# EAGLE design RocketometerATMega (EAGLE 6.3)
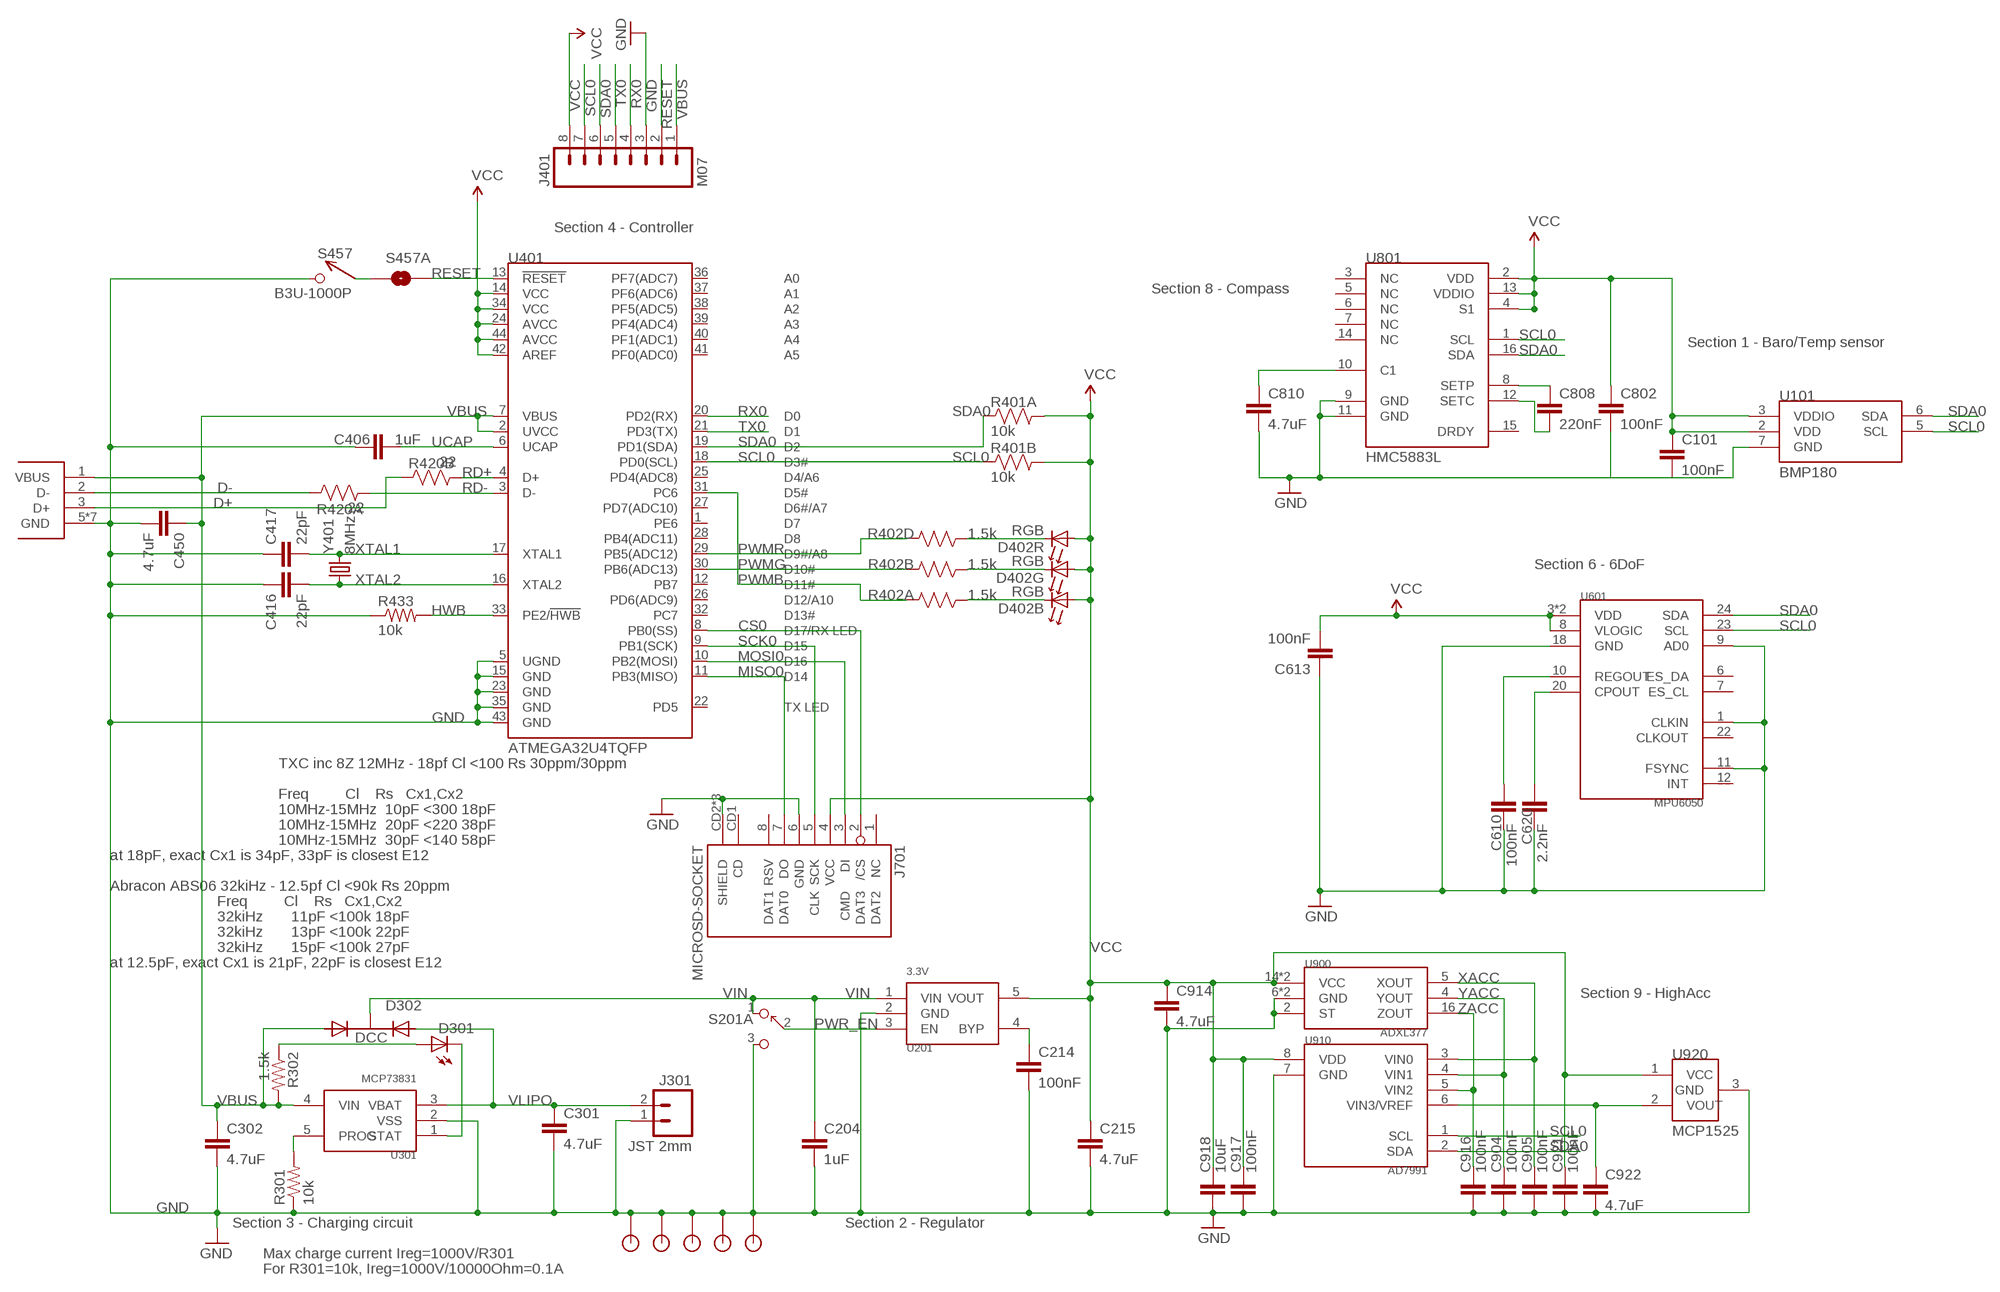
[diagram p0: schematic, sheet 1]

## Parts
C101  100nF  CAP0402-CAP  [0402-CAP]
C204  1uF  CAP0402-CAP  [0402-CAP]
C214  100nF  CAP0402-CAP  [0402-CAP]
C215  4.7uF  CAP0402-CAP  [0402-CAP]
C301  4.7uF  CAP0402-CAP  [0402-CAP]
C302  4.7uF  CAP0402-CAP  [0402-CAP]
C406  1uF  CAP0402-CAP  [0402-CAP]
C416  22pF  CAP0402-CAP  [0402-CAP]
C417  22pF  CAP0402-CAP  [0402-CAP]
C450  4.7uF  CAP0402-CAP  [0402-CAP]
C610  100nF  CAP0402-CAP  [0402-CAP]
C613  100nF  CAP0402-CAP  [0402-CAP]
C620  2.2nF  CAP0402-CAP  [0402-CAP]
C802  100nF  CAP0402-CAP  [0402-CAP]
C808  220nF  CAP0402-CAP  [0402-CAP]
C810  4.7uF  CAP0402-CAP  [0402-CAP]
C904  100nF  CAP0402-CAP  [0402-CAP]
C905  100nF  CAP0402-CAP  [0402-CAP]
C914  4.7uF  CAP0402-CAP  [0402-CAP]
C916  100nF  CAP0402-CAP  [0402-CAP]
C917  100nF  CAP0402-CAP  [0402-CAP]
C918  10uF  CAP0603-CAP  [0603-CAP]
C921  100nF  CAP0402-CAP  [0402-CAP]
C922  4.7uF  CAP0402-CAP  [0402-CAP]
D301  YELLOW  LED0603  [LED-0603]
D302  DCC  PMEG2005CT  [SOT-23-3]
D402  RGB  SMLP36RGB2W(R)  [SMLP36]
J301  JST 2mm  M02-JST-2MM-SMT  [JST-2-SMD]
J400  USB_MICROB_JSTGCT  [USB_MICROB_3075]
J401  M07  M081X08  [1X08]
J701  MICROSD-SOCKET  [MICROSD-SOCKET-PP]
JP1  STANDOFF  [STANDOFF]
JP2  STANDOFF  [STANDOFF]
JP3  STANDOFF  [STANDOFF]
JP4  STANDOFF  [STANDOFF]
JP5  STANDOFF  [STANDOFF]
R301  10k  RESISTOR0402-RES  [0402-RES]
R302  1.5k  RESISTOR0402-RES  [0402-RES]
R401  10k  RP2EXB24V  [CRA02]
R402  1.5k  RP404  [CRA04]
R420  22  RP2EXB24V  [CRA02]
R433  10k  RESISTOR0402-RES  [0402-RES]
S201  AYZ0202  [AYZ0202]
S457  B3U-1000P  [B3U-1000P]
S457A  SOLDERJUMPERNO  [SJ_2S-NO]
U101  BMP180  [BMP180]
U201  3.3V  MIC5319D5  [SOT-23-5]
U301  MCP73831  [SOT-23-5]
U401  ATMEGA32U4TQFP  [SPARKFUN-DIGITALIC_TQFP44]
U601  MPU6050  [MPU60X0]
U801  HMC5883L  HMC5883LSMD  [16LPCC]
U900  ADXL377  [ADXL377]
U910  AD7991  AD799X  [SOT-23-8]
U920  MCP1525  [SOT-23-3]
Y401  8MHz  NX3225GD  [CRYSTAL_SMD_3_2MM_2_5MM]

## Nets
CS0: J701.2(/CS) U401.8(PB0(SS))
D+: J400.3(D+) R420.2
D-: J400.2(D-) R420.1
GND [power]: C101.2 C204.2 C214.2 C215.2 C301.2 C302.2 C406.2 C416.1 C417.1 C450.2 C610.2 C613.1 C620.1 C802.2 C810.2 C904.2 C905.2 C914.2 C916.2 C917.2 C918.2 C921.2 C922.2 J301.1 J400.5(GND) J400.P$1(GND) J400.P$2(GND) J400.P$3(GND) J400.P$4(GND) J400.P$8(GND) J400.P$10(GND) J401.3 J701.6(GND) J701.CD2(SHIELD) J701.GND1(SHIELD) J701.GND3(SHIELD) JP1.P$1 JP2.P$1 JP3.P$1 JP4.P$1 JP5.P$1 R301.1 R433.1 S201.3 S457.P$2 U101.7(GND) U201.2(GND) U301.2(VSS) U401.5(UGND) U401.15(GND) U401.23(GND) U401.35(GND) U401.43(GND) U601.1(CLKIN) U601.9(AD0) U601.11(FSYNC) U601.18(GND) U801.9(GND) U801.11(GND) U900.2(ST) U900.6(GND) U900.7(GND) U910.7(GND) U920.3(GND)
HWB: R433.2 U401.33(PE2/!HWB)
MISO0: J701.7(DO) U401.11(PB3(MISO))
MOSI0: J701.3(DI) U401.10(PB2(MOSI))
N$1: C620.2 U601.20(CPOUT)
N$2: R301.2 U301.5(PROG)
N$3 [power]: S457.P$1 S457A.1
N$4: D301.C U301.1(STAT)
N$5: D301.A R302.1
N$10: C922.1 U910.6(VIN3/VREF) U920.2(VOUT)
N$13: C610.1 U601.10(REGOUT)
N$14: C808.1 U801.8(SETP)
N$15: C808.2 U801.12(SETC)
N$16: C810.1 U801.10(C1)
N$17: C214.1 U201.4(BYP)
PWMB: R402.8 U401.31(PC6)
PWMG: R402.7 U401.30(PB6(ADC13))
PWMR: R402.5 U401.29(PB5(ADC12))
PWR_EN: S201.2 U201.3(EN)
QWMB: D402.1(B:C) R402.1
QWMG: D402.3(G:C) R402.2
QWMR: D402.5(R:C) R402.4
RD+: R420.3 U401.4(D+)
RD-: R420.4 U401.3(D-)
RESET [power]: J401.2 S457A.2 U401.13(!RESET)
RX0: J401.4 U401.20(PD2(RX))
SCK0: J701.5(SCK) U401.9(PB1(SCK))
SCL0: J401.7 R401.2 U101.5(SCL) U401.18(PD0(SCL)) U601.23(SCL) U801.1(SCL) U910.1(SCL)
SDA0: J401.6 R401.1 U101.6(SDA) U401.19(PD1(SDA)) U601.24(SDA) U801.16(SDA) U910.2(SDA)
TX0: J401.5 U401.21(PD3(TX))
UCAP: C406.1 U401.6(UCAP)
VBUS: C302.1 C450.1 D302.1(A1) J400.1(VBUS) J401.1 R302.2 U301.4(VIN) U401.2(UVCC) U401.7(VBUS)
VCC [power]: C101.1 C215.1 C613.2 C802.1 C914.1 C917.1 C918.1 C921.1 D402.2(B:A) D402.4(G:A) D402.6(R:A) J401.8 J701.4(VCC) R401.3 R401.4 U101.2(VDD) U101.3(VDDIO) U201.5(VOUT) U401.14(VCC) U401.24(AVCC) U401.34(VCC) U401.42(AREF) U401.44(AVCC) U601.3(VDD) U601.8(VLOGIC) U601.13(VDD) U801.2(VDD) U801.4(S1) U801.13(VDDIO) U900.14(VCC) U900.15(VCC) U910.8(VDD) U920.1(VCC)
VIN: C204.1 D302.3(K) S201.1 U201.1(VIN)
VLIPO: C301.1 D302.2(A2) J301.2 U301.3(VBAT)
XACC: C905.1 U900.5(XOUT) U910.3(VIN0)
XTAL1: C417.2 U401.17(XTAL1) Y401.2
XTAL2: C416.2 U401.16(XTAL2) Y401.1
YACC: C904.1 U900.4(YOUT) U910.4(VIN1)
ZACC: C916.1 U900.16(ZOUT) U910.5(VIN2)
Unconnected: J701.1(NC) J701.8(RSV) J701.CD1(CD) R402.3 R402.6 S201.4 S201.5 S201.6 U401.1(PE6) U401.12(PB7) U401.22(PD5) U401.25(PD4(ADC8)) U401.26(PD6(ADC9)) U401.27(PD7(ADC10)) U401.28(PB4(ADC11)) U401.32(PC7) U401.36(PF7(ADC7)) U401.37(PF6(ADC6)) U401.38(PF5(ADC5)) U401.39(PF4(ADC4)) U401.40(PF1(ADC1)) U401.41(PF0(ADC0)) U601.6(ES_DA) U601.7(ES_CL) U601.12(INT) U601.22(CLKOUT) U801.3(NC) U801.5(NC) U801.6(NC) U801.7(NC) U801.14(NC) U801.15(DRDY)

## Notes on the sheet
- Section 4 - Controller
- Section 8 - Compass
- Section 1 - Baro/Temp sensor
- Section 6 - 6DoF
- TXC inc 8Z 12MHz - 18pf Cl <100 Rs 30ppm/30ppm
- Freq         Cl    Rs   Cx1,Cx2
- 10MHz-15MHz  10pF <300 18pF
- 10MHz-15MHz  20pF <220 38pF
- 10MHz-15MHz  30pF <140 58pF
- at 18pF, exact Cx1 is 34pF, 33pF is closest E12
- Abracon ABS06 32kiHz - 12.5pf Cl <90k Rs 20ppm
- Freq         Cl    Rs   Cx1,Cx2
- 32kiHz       11pF <100k 18pF
- 32kiHz       13pF <100k 22pF
- 32kiHz       15pF <100k 27pF
- at 12.5pF, exact Cx1 is 21pF, 22pF is closest E12
- Section 9 - HighAcc
- Section 3 - Charging circuit | Section 2 - Regulator
- Max charge current Ireg=1000V/R301
- For R301=10k, Ireg=1000V/10000Ohm=0.1A

## Library data of the parts
C101 C214 C610 C613 C802 C904 C905 C916 = SparkFun:CAP: Capacitor Standard 0603 ceramic capacitor, and 0.1" leaded capacitor.; DIGIKEY: 445-1265-1-ND
C204 = SparkFun:CAP: Capacitor Standard 0603 ceramic capacitor, and 0.1" leaded capacitor.; DIGIKEY: 445-4114-1-ND
C215 C301 C302 C810 C914 C922 = SparkFun:CAP: Capacitor Standard 0603 ceramic capacitor, and 0.1" leaded capacitor.; DIGIKEY: 445-7395-1-ND
C406 = SparkFun-Passives:CAP: Capacitor Standard 0603 ceramic capacitor, and 0.1" leaded capacitor.; DIGIKEY: 445-4114-1-ND
C416 C417 = SparkFun:CAP: Capacitor Standard 0603 ceramic capacitor, and 0.1" leaded capacitor.; DIGIKEY: 445-1239-1-ND
C450 = SparkFun-Passives:CAP: Capacitor Standard 0603 ceramic capacitor, and 0.1" leaded capacitor.; DIGIKEY: 445-7395-1-ND
C620 = SparkFun:CAP: Capacitor Standard 0603 ceramic capacitor, and 0.1" leaded capacitor.; DIGIKEY: 445-1257-1-ND
C808 = SparkFun:CAP: Capacitor Standard 0603 ceramic capacitor, and 0.1" leaded capacitor.; DIGIKEY: 445-5938-1-ND
C917 C921 = SparkFun-Passives:CAP: Capacitor Standard 0603 ceramic capacitor, and 0.1" leaded capacitor.; DIGIKEY: 445-1265-1-ND
C918 = SparkFun:CAP: Capacitor Standard 0603 ceramic capacitor, and 0.1" leaded capacitor.; DIGIKEY: 445-7486-1-ND
D301 = SparkFun:LED: LEDs Standard schematic elements and footprints for 5mm, 3mm, 1206, and 0603 sized LEDs. 5mm - Spark Fun Electronics SKU : COM-00529 (and others); DIGIKEY: 350-2032-1-ND
D302 = KwanSystems:PMEG2005CT; DIGIKEY: 568-6500-1-ND
D402 = KwanSystems:SMLP36RGB2W(R); DIGIKEY: 846-1097-1-ND
J301 = SparkFun:M02: Header 2 Standard 2-pin 0.1" header. Use with straight break away headers (SKU : PRT-00116), right angle break away headers (PRT-00553), swiss pins (PRT-00743), machine pins (PRT-00117), and female headers (PRT-00115). Molex polarized connector foot print use with SKU : PRT-08233 with associated crimp pins and housings.; DIGIKEY: 455-1749-1-ND
J400 = KwanSystems:USB_MICROB_JST; DIGIKEY: 609-4616-2-ND
J401 = SparkFun-Connectors:M08: Header 8 Standard 8-pin 0.1" header. Use with straight break away headers (SKU : PRT-00116), right angle break away headers (PRT-00553), swiss pins (PRT-00743), machine pins (PRT-00117), and female headers (PRT-00115).; DIGIKEY: $NOPART
J701 = KwanSystems:MICROSD-SOCKET: microSD Socket Push-push type uSD socket. Digikey 101-00660-68-6-1-ND. tDoc lines correctly indicate media card edge positions when inserting (unlocked, locked, depressed).; DIGIKEY: 101-00581-59-1-ND
JP1-JP5 = KwanSystems:STANDOFF; DIGIKEY: $NOPART
R301 = SparkFun:RESISTOR: Resistor Basic schematic elements and footprints for 0603, 1206, and PTH resistors.; DIGIKEY: P10.0KLCT-ND
R302 = SparkFun:RESISTOR: Resistor Basic schematic elements and footprints for 0603, 1206, and PTH resistors.; DIGIKEY: P1.50KLCT-ND
R401 = KwanSystems:RP2; DIGIKEY: Y5103CT-ND
R402 = KwanSystems:RP4; DIGIKEY: CRA4S81.5KCT-ND
R420 = KwanSystems:RP2; DIGIKEY: Y5220CT-ND
R433 = SparkFun-Passives:RESISTOR: Resistor Basic schematic elements and footprints for 0603, 1206, and PTH resistors.; DIGIKEY: P10.0KLCT-ND
S201 = KwanSystems:AYZ0202; DIGIKEY: 401-2013-1-ND
S457 = KwanSystems:B3U-1000P; DIGIKEY: SW1020CT-ND
S457A = SparkFun-Passives:SOLDERJUMPER: Solder Jumper Standard SMD solder jumper. Used to automate production. Two varients : Normally Open and Normally Closed are the same, but have different paste layers. NC will have a large amount of paste and should jumper during reflow.; DIGIKEY: $NOPART
U101 = KwanSystems:BMP180; DIGIKEY: 828-1027-1-ND
U201 = KwanSystems:MIC5319; DIGIKEY: 576-1910-1-ND
U301 = KwanSystems:MCP73831; DIGIKEY: 576-1910-1-ND
U401 = SparkFun-DigitalIC:ATMEGA32U4: Atmel 44-pin 8-bit Microcontroller with 32KBytes of ISP Flash and USB Controller; DIGIKEY: ATMEGA32U4-AURCT-ND
U601 = KwanSystems:MPU6050: MPU6050 or MPU9150 Pin 3 is NC on the '6050, VDD on the '9150. Since pin 3 is not internally connected, a socket for the '9150 is compatible with a '6050.; DIGIKEY: $NOPART
U801 = SparkFun:HMC5883L: 3 Axis Digital Compass IC; DIGIKEY: 342-1082-1-ND; LABEL_3D50: 5883
U900 = KwanSystems:ADXL377; DIGIKEY: ADXL377BCPZ-RL7CT-ND
U910 = KwanSystems:AD799X; DIGIKEY: AD7991YRJZ-0500RL7CT-ND
U920 = KwanSystems:MCP1525; DIGIKEY: MCP1525T-I/TTCT-ND
Y401 = KwanSystems:NX3225GD; DIGIKEY: 644-1178-1-ND

## Net classes
0 default: width 0.152 mm, drill 0.33 mm, clearance 0.152 mm
1 power: width 0.152 mm, drill 0.33 mm, clearance 0.152 mm to class 0, clearance 0.152 mm
2 hv: width 0.152 mm, drill 0.33 mm, clearance 0.152 mm to class 0, clearance 0.152 mm to class 1, clearance 0.152 mm

## Board
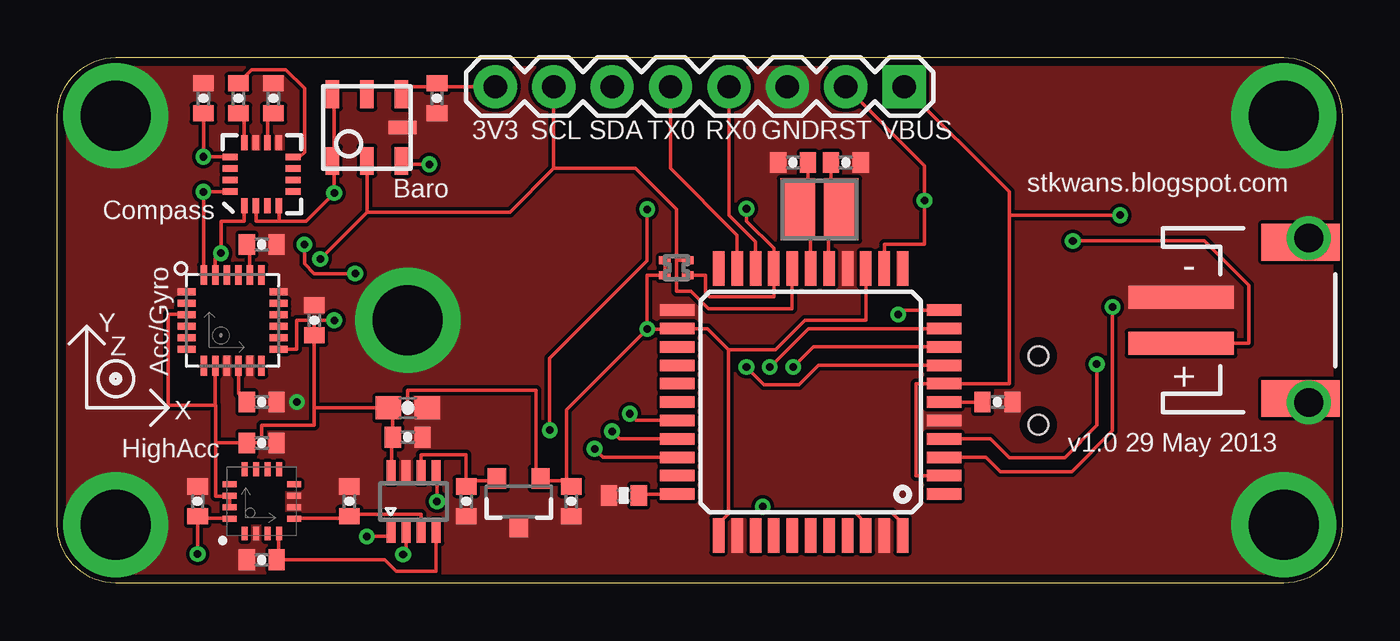
[diagram p1: board, top side]
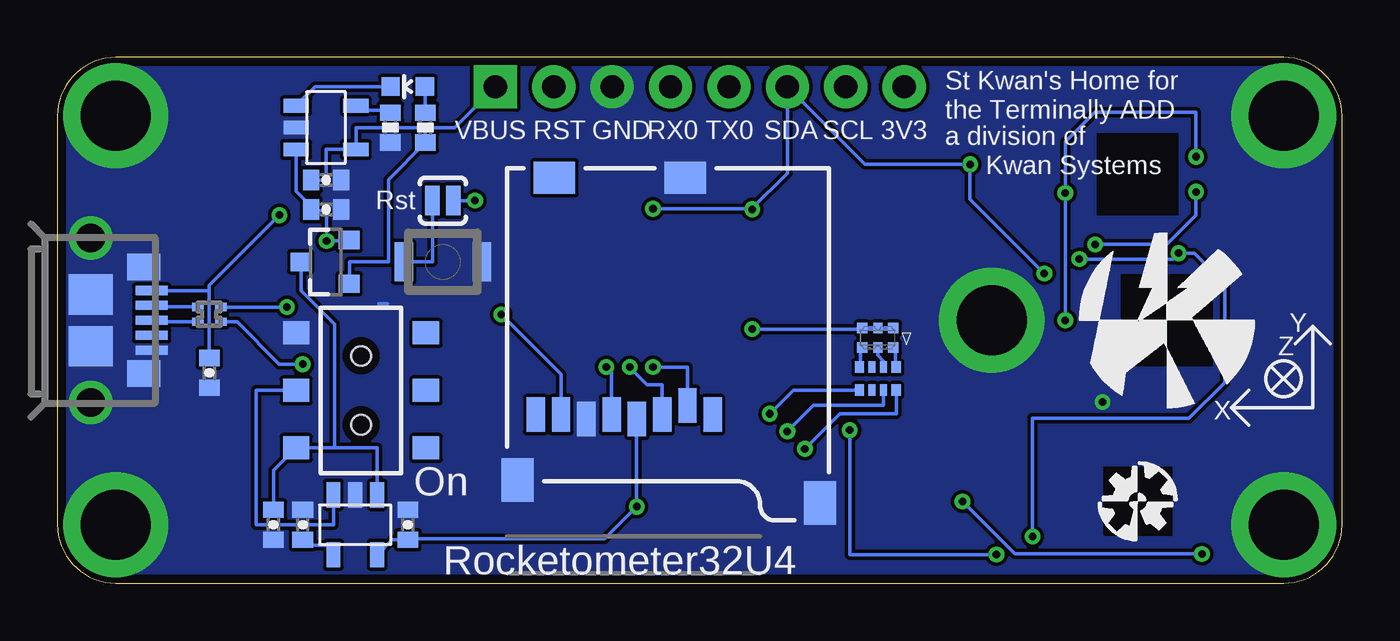
[diagram p2: board, bottom side, seen from below]

Size 55.88 x 22.86 mm. Coordinates in mm from the lower left corner, seen from the top.
Outline: 2.54,22.86 53.34,22.86 arc-90 55.88,20.32 55.88,2.54 arc-90 53.34,0 2.54,0 arc-90 0,2.54 0,20.32 arc-90 2.54,22.86
Copper layers (1*16): Top 0.0356mm / dielectric 1.5011mm / Bottom 0.0356mm
Design rules "default": minimum track width 6mil, minimum drill 13mil, track to track 6mil, track to pad 6mil, pad to pad 6mil, via to via 6mil, smd to smd 6mil, copper to edge 15mil, drill to drill 6mil, minimum pad ring 7mil, minimum via ring 7mil, stop-mask expansion 4mil, vias tented up to drill 14mil, thermal gap 10mil
tRestrict: area 7.9,16.8 to 9.9,18.8; area 9.9,18.8 to 10.7,19.6; area 9.9,16 to 10.7,16.8; area 7.1,18.8 to 7.9,19.6; area 7.1,16 to 7.9,16.8; area 1.3,19.1 to 3.8,21.6; area 14,10.2 to 16.5,12.7; area 1.3,1.3 to 3.8,3.8; area 52.1,1.3 to 54.6,3.8; area 52.1,19.1 to 54.6,21.6
bRestrict: area 7.1,16 to 10.7,19.6; area 1.3,19.1 to 3.8,21.6; area 14,10.2 to 16.5,12.7; area 1.3,1.3 to 3.8,3.8; area 52.1,1.3 to 54.6,3.8; area 52.1,19.1 to 54.6,21.6

### Footprints (pad centres in the part's own frame; a part is rotated, then mirrored left to right if it is on the bottom)
0402-CAP = smd 0.7 x 0.9: 1 -0.65,0; 2 0.65,0
0603-CAP = smd 1.1 x 1: 1 -0.85,0; 2 0.85,0
LED-0603 = smd 0.8 x 0.8: A 0,-0.75; C 0,0.75
SOT-23-3 = smd 0.9 x 0.8: 1 -1,0.95; 2 -1,-0.95; 3 1.1,0
SMLP36 = smd 0.45 x 0.45: 1 -0.675,0.425; 2 -0.675,-0.425; 5 0.675,0.425; 6 0.675,-0.425 | smd 0.4 x 0.45: 3 0,0.425; 4 0,-0.425
JST-2-SMD = smd 1 x 4.6: 1 -1,-3.7; 2 1,-3.7 | smd 1.6 x 3.4: NC1 -3.4,1.5; NC2 3.4,1.5
USB_MICROB_3075 = smd 0.4 x 1.4: 1 -1.3,4.1; 2 -0.65,4.1; 3 0,4.1; 4 0.65,4.1; 5 1.3,4.1 | smd 1.15 x 1.45: P$1 2.32,3.75; P$10 -2.32,3.75 | smd 1.75 x 1.9: P$2 1.125,1.45; P$8 -1.125,1.45 | drill 1.25 pad 1.9: P$3 -3.575,1.45; P$4 3.575,1.45
1X08 = drill 1.016 pad 1.88 square: 1 0,0 | drill 1.016 pad 1.88: 2 2.54,0; 3 5.08,0; 4 7.62,0; 5 10.16,0; 6 12.7,0; 7 15.24,0; 8 17.78,0
MICROSD-SOCKET-PP = smd 0.8 x 1.5: 1 -8.94,10.7; 2 -7.84,10.3; 3 -6.74,10.7; 4 -5.64,10.9; 5 -4.54,10.7; 6 -3.44,10.9; 7 -2.34,10.7; 8 -1.24,10.7 | smd 1.8 x 1.4: CD1 -2.05,0.4; CD2 -7.75,0.4 | smd 1.4 x 1.9: GND1 -13.6,14.55; GND3 -0.45,13.55
STANDOFF = drill 3.048 pad 4.572: P$1 0,0
0402-RES = smd 0.7 x 0.9: 1 -0.65,0; 2 0.65,0
CRA02 = smd 0.35 x 0.5: 1 -0.325,-0.5; 2 0.325,-0.5; 3 0.325,0.5; 4 -0.325,0.5
CRA04 = smd 0.4 x 0.5: 1 -0.8,-0.5; 4 0.8,-0.5; 5 0.8,0.5; 8 -0.8,0.5 | smd 0.3 x 0.5: 2 -0.25,-0.5; 3 0.25,-0.5; 6 0.25,0.5; 7 -0.25,0.5
AYZ0202 = smd 1 x 1.15: 1 -2.5,2.825; 2 0,2.825; 3 2.5,2.825; 4 -2.5,-2.825; 5 0,-2.825; 6 2.5,-2.825 | hole 0.85: 1.5,0; -1.5,0
B3U-1000P = smd 0.8 x 1.7: P$1 -1.7,0; P$2 1.7,0
SJ_2S-NO = smd 0.635 x 1.27: 1 -0.45,0; 2 0.45,0
BMP180 = smd 0.6 x 1.2: 1 1.5,1.45; 2 0,1.45; 3 -1.5,1.45; 4 -1.5,-1.45; 5 0,-1.45; 6 1.5,-1.45 | smd 1.2 x 0.6: 7 1.55,0
SOT-23-5 = smd 0.6 x 1.1: 1 -0.95,-1.3; 2 0,-1.3; 3 0.95,-1.3; 4 0.95,1.3; 5 -0.95,1.3
SPARKFUN-DIGITALIC_TQFP44 = smd 1.5 x 0.5: 1 -5.8,4; 2 -5.8,3.2; 3 -5.8,2.4; 4 -5.8,1.6; 5 -5.8,0.8; 6 -5.8,0; 7 -5.8,-0.8; 8 -5.8,-1.6; 9 -5.8,-2.4; 10 -5.8,-3.2; 11 -5.8,-4; 23 5.8,-4; 24 5.8,-3.2; 25 5.8,-2.4; 26 5.8,-1.6; 27 5.8,-0.8; 28 5.8,0; 29 5.8,0.8; 30 5.8,1.6; 31 5.8,2.4; 32 5.8,3.2; 33 5.8,4 | smd 0.5 x 1.5: 12 -4,-5.8; 13 -3.2,-5.8; 14 -2.4,-5.8; 15 -1.6,-5.8; 16 -0.8,-5.8; 17 0,-5.8; 18 0.8,-5.8; 19 1.6,-5.8; 20 2.4,-5.8; 21 3.2,-5.8; 22 4,-5.8; 34 4,5.8; 35 3.2,5.8; 36 2.4,5.8; 37 1.6,5.8; 38 0.8,5.8; 39 0,5.8; 40 -0.8,5.8; 41 -1.6,5.8; 42 -2.4,5.8; 43 -3.2,5.8; 44 -4,5.8
MPU60X0 = smd 0.8 x 0.3: 1 -2,1.25; 2 -2,0.75; 3 -2,0.25; 4 -2,-0.25; 5 -2,-0.75; 6 -2,-1.25; 13 2,-1.25; 14 2,-0.75; 15 2,-0.25; 16 2,0.25; 17 2,0.75; 18 2,1.25 | smd 0.3 x 0.85: 7 -1.25,-1.975; 8 -0.75,-1.975; 9 -0.25,-1.975; 10 0.25,-1.975; 11 0.75,-1.975; 12 1.25,-1.975; 19 1.25,1.975; 20 0.75,1.975; 21 0.25,1.975; 22 -0.25,1.975; 23 -0.75,1.975; 24 -1.25,1.975
16LPCC = smd 0.65 x 0.28: 1 -1.37,0.75; 2 -1.37,0.25; 3 -1.37,-0.25; 4 -1.37,-0.75; 9 1.37,-0.75; 10 1.37,-0.25; 11 1.37,0.25; 12 1.37,0.75 | smd 0.28 x 0.65: 5 -0.75,-1.37; 6 -0.25,-1.37; 7 0.25,-1.37; 8 0.75,-1.37; 13 0.75,1.37; 14 0.25,1.37; 15 -0.25,1.37; 16 -0.75,1.37
ADXL377 = smd 0.6 x 0.25: 1 -1.4,0.75; 2 -1.4,0.25; 3 -1.4,-0.25; 4 -1.4,-0.75; 9 1.4,-0.75; 10 1.4,-0.25; 11 1.4,0.25; 12 1.4,0.75 | smd 0.25 x 0.6: 5 -0.75,-1.4; 6 -0.25,-1.4; 7 0.25,-1.4; 8 0.75,-1.4; 13 0.75,1.4; 14 0.25,1.4; 15 -0.25,1.4; 16 -0.75,1.4
SOT-23-8 = smd 0.4 x 1: 1 -0.975,-1.3; 2 -0.325,-1.3; 3 0.325,-1.3; 4 0.975,-1.3; 5 0.975,1.3; 6 0.325,1.3; 7 -0.325,1.3; 8 -0.975,1.3
CRYSTAL_SMD_3_2MM_2_5MM = smd 1.5 x 2.7: 1 -0.95,0; 2 0.95,0

### Placement (x,y rotation side)
C101  16.51,21.08 270 top
C204  46.48,2.54 270 bottom
C214  45.21,2.54 90 bottom
C215  40.64,2.54 90 bottom
C301  44.2,16.26 0 bottom
C302  44.2,17.53 0 bottom
C406  40.89,7.87 0 top
C416  34.29,18.29 180 top
C417  32,18.29 0 top
C450  49.28,9.14 270 bottom
C610  8.89,7.87 0 top
C613  11.18,11.43 270 top
C620  8.89,14.73 180 top
C802  6.35,21.08 90 top
C808  7.87,21.08 270 top
C810  9.4,21.08 90 top
C904  8.89,1.02 180 top
C905  12.7,3.56 90 top
C914  8.89,6.1 0 top
C916  6.1,3.56 90 top
C917  15.24,6.35 0 top
C918  15.24,7.62 0 top
C921  22.35,3.56 270 top
C922  17.78,3.56 270 top
D301  40.64,21.59 90 bottom
D302  44.2,13.97 180 bottom
D402  20.19,10.67 180 bottom
J301  52.58,11.43 270 top
J400  55.88,11.43 270 bottom
J401  36.83,21.59 180 top
J701  36.31,18.03 180 bottom
JP1  2.54,2.54 0 top
JP2  2.54,20.32 0 top
JP3  15.24,11.43 0 top
JP4  53.34,2.54 0 top
JP5  53.34,20.32 0 top
R301  41.4,19.81 90 bottom
R302  39.88,19.81 270 bottom
R401  26.92,13.72 90 top
R402  20.19,8.89 180 bottom
R420  49.28,11.68 270 bottom
R433  24.64,3.81 0 top
S201  42.67,8.38 90 bottom
S457  39.12,13.97 0 bottom
S457A  39.12,16.64 0 bottom
U101  13.46,19.81 0 top
U201  42.93,2.54 180 bottom
U301  44.2,19.81 270 bottom
U401  32.77,7.87 180 top
U601  7.62,11.43 0 top
U801  8.89,17.78 90 top
U900  8.89,3.56 90 top
U910  15.49,3.56 0 top
U920  20.07,3.56 270 top
U$4  [AXES]  1.27,7.62 0 top
U$5  [KWAN_ACC]  7.62,11.43 0 bottom
U$6  [OSHW_ACC]  8.89,3.56 0 bottom
Y401  33.15,16.26 180 top

### Tracks (layer width: path | path; a pad name or v marks a point on that pad's centre or on a via)
CS0  (via drill 0.33)
  Top 0.152: U401.8 33.1,9.47 32.26,8.64 30.73,8.64 v29.97,9.4
  Bottom 0.152: v29.97,9.4 28.47,9.4 J701.2
D+
  Bottom 0.152: R420.2 49.78,11.38 51.71,11.38 51.77,11.43 J400.3
D-
  Bottom 0.152: R420.1 51.71,12.01 51.77,12.06 J400.2
GND  (via drill 0.33)
  Bottom 0.152: 41.53,12.14 41.91,12.14
  other vias: 10.41,7.87
  pour Top (no thermals): 2.54,22.86 53.34,22.86 arc-90 55.88,20.32 55.88,2.54 arc-90 53.34,0 2.54,0 arc-90 0,2.54 0,20.32 arc-90
  pour Bottom (no thermals): 2.54,22.86 53.34,22.86 arc-90 55.88,20.32 55.88,2.54 arc-90 53.34,0 2.54,0 arc-90 0,2.54 0,20.32 arc-90
HWB
  Top 0.152: U401.33 25.29,3.87 R433.2
MISO0  (via drill 0.33)
  Top 0.152: U401.11 36.77,11.87 v36.58,11.68
  Bottom 0.152: v36.58,11.68 33.97,9.08 J701.7
MOSI0  (via drill 0.33)
  Top 0.152: U401.10 32.66,11.07 v30.99,9.4
  Bottom 0.152: v30.99,9.4 30.23,8.64 29.57,8.64 J701.3
N$1
  Top 0.152: U601.20 8.36,13.41 8.36,14.63 8.26,14.73 C620.2
N$2
  Bottom 0.152: R301.2 41.51,20.57 42.9,20.57 U301.5
N$3
  Bottom 0.152: S457A.1 39.57,13.97 S457.P$1
N$4
  Bottom 0.152: D301.C 44.68,21.59 45.49,20.78 U301.1
N$5
  Bottom 0.152: R302.1 39.88,21.59 D301.A
N$10
  Top 0.152: U920.2 19.12,4.45 18.02,4.45 arc90 C922.1 17.78,5.59 15.82,5.59 U910.6
N$13
  Top 0.152: U601.10 7.87,8.23 C610.1
N$14
  Top 0.152: U801.8 10.26,18.54 10.54,18.54 10.74,18.75 10.74,21.51 9.93,22.33 8.46,22.33 7.87,21.74 C808.1
N$15
  Top 0.152: U801.12 8.13,19.15 8.13,20.17 C808.2
N$16
  Top 0.152: U801.10 9.14,20.17 C810.1
N$17
  Bottom 0.152: C214.1 44.97,1.65 43.88,1.65 U201.4
PWMB  (via drill 0.33)
  Top 0.152: U401.31 23.74,5.47 v23.37,5.84
  Bottom 0.152: 19.43,8.35 R402.8 19.39,7.37 21.84,7.37 v23.37,5.84
PWMG  (via drill 0.33)
  Top 0.152: U401.30 24.46,6.27 v24.13,6.6
  Bottom 0.152: R402.7 19.94,7.75 22.99,7.75 v24.13,6.6
PWMR  (via drill 0.33)
  Top 0.152: 26.98,7.09 27.51,7.09 | 26.98,7.09 U401.29 | 26.98,7.09 25.17,7.09 v24.89,7.37
  Bottom 0.152: 20.95,8.35 R402.5 23.87,8.39 v24.89,7.37
PWR_EN
  Bottom 0.152: S201.2 47.24,8.38 47.24,2.54 43.88,2.54 U201.3
QWMB
  Bottom 0.152: R402.1 19.43,9.39 19.43,10.16 D402.1
QWMG
  Bottom 0.152: R402.2 19.94,9.66 20.19,9.91 D402.3
QWMR
  Bottom 0.152: R402.4 20.95,9.43 20.95,10.24 D402.5
RD+  (via drill 0.33)
  Top 0.152: U401.4 40.59,6.27 41.4,5.46 43.81,5.46 45.21,6.86 v45.21,9.53
  Bottom 0.152: 48.77,11.35 R420.3 48.06,11.36 46.23,9.53 v45.21,9.53
RD-  (via drill 0.33)
  Top 0.152: v45.9,12.01 45.9,6.63 44.12,4.85 41.02,4.85 40.4,5.47 U401.3
  Bottom 0.152: 45.74,11.99 v45.9,12.01 45.77,12.01 R420.4 48.77,11.99
RESET  (via drill 0.33)
  Top 0.152: U401.13 35.97,14.73 37.72,14.73 v37.72,16.64 37.72,18.16 J401.2
  Bottom 0.152: S457A.2 v37.72,16.64
RX0
  Top 0.152: U401.20 30.37,14.85 29.21,16 J401.4
SCK0  (via drill 0.33)
  Top 0.152: U401.9 32.88,10.27 v32,9.4
  Bottom 0.152: v32,9.4 31.77,9.17 J701.5
SCL0  (via drill 0.33)
  Top 0.152: 8.13,16.41 U801.1 8.13,16.4 8.13,15.75 7.11,15.75 v7.11,14.35 6.87,14.11 U601.23 | U910.1 14.5,2.26 14.5,2.03 v13.46,2.03 | U401.18 31.95,13.66 31.95,11.94 28.32,11.94 27.56,12.7 26.92,12.7 26.92,14.04 | 26.92,14.04 R401.2 | 26.92,14.04 26.92,16.26 25.15,18.03 21.59,18.03 | 21.59,18.03 J401.7 | v11.43,14.1 13.46,16.13 | 13.46,16.13 U101.5 | 21.59,18.03 19.68,16.13 13.46,16.13
  Bottom 0.152: v11.43,14.1 7.37,14.1 v7.11,14.35 6.43,14.35 5.11,13.03 5.11,8.71 6.66,7.16 13.46,7.16 v13.46,2.03
SDA0  (via drill 0.33)
  Top 0.152: v15.04,1.25 15.16,1.37 15.16,2.23 U910.2 | v21.41,6.66 21.41,9.78 25.65,14.02 v25.65,16.26 | v29.97,16.28 29.97,15.75 31.17,14.55 31.17,13.69 U401.19 31.17,12.45 28.37,12.45 28.19,12.62 28.19,13.39 R401.1 27.43,13.39 | v10.74,14.73 10.74,13.89 11.18,13.46 v12.95,13.46 | U101.6 15.11,18.21 v16.18,18.21 | U801.16 7.51,17.02 v6.35,17.02 6.35,13.43 U601.24
  Bottom 0.152: v25.65,16.26 25.68,16.28 | 25.68,16.28 v29.97,16.28 | 25.68,16.28 24.13,17.83 J401.6 20.75,18.21 v16.18,18.21 16.18,16.69 v12.95,13.46 | v10.74,14.73 7.62,14.73 6.35,16 v6.35,17.02 | v15.04,1.25 21.41,1.25 v21.41,6.66
TX0
  Top 0.152: U401.21 29.57,15.14 26.67,18.03 J401.5
UCAP
  Top 0.152: U401.6 C406.1
VBUS  (via drill 0.33)
  Top 0.152: U401.2 37.34,4.67 37.34,8.67 U401.7 41.4,8.67 41.4,16 | 41.4,16 v46.23,16 | 41.4,16 41.4,17.02 J401.1
  Bottom 0.152: D302.1 43.18,13.03 43.18,13.97 41.48,13.97 41.48,17.55 R302.2 | 42.82,18.87 42.88,18.87 U301.4 | 49.28,12.72 51.77,12.72 J400.1 | 49.17,9.65 C450.1 49.28,12.72 | 44.83,17.53 C302.1 44.2,17.53 44.2,18.86 U301.4 | J401.1 38.61,19.81 39.88,19.81 | 39.8,19.18 R302.2 | R302.2 39.88,19.81 | 39.88,19.81 42.9,19.81 U301.4 | 49.28,12.72 49.28,12.95 v46.23,16
VCC  (via drill 0.33)
  Top 0.152: 35.15,13.66 U401.14 35.17,11.43 32.51,11.43 31.24,10.16 29.18,10.16 | 29.23,3.07 28.78,2.62 28.78,2.08 U401.34 | 30.68,3.07 34.7,3.07 34.75,3.02 | 30.68,3.07 29.23,3.07 | 34.75,3.02 35.15,2.62 35.15,2.08 U401.42 | 30.68,3.07 v30.68,3.33 | U401.44 36.75,2.08 36.75,2.62 36.3,3.07 34.8,3.07 34.75,3.02 | 29.18,10.16 29.18,3.12 29.23,3.07 | 7.49,3.79 7.49,3.33 U900.15 | 7.49,3.79 U900.14 | C914.1 | 22.1,4.22 C921.1 | U601.13 10.41,10.18 10.41,11.43 11.18,11.43 | 11.18,10.26 C613.2 | C918.1 14.4,7.62 14.58,7.44 C917.1 14.53,6.3 14.53,4.88 U910.8 | 14.61,7.52 C918.1 | C921.1 22.15,4.27 22.15,7.54 v25.65,11.05 | 29.18,10.16 28.27,11.07 U401.24 26.95,11.05 v25.65,11.05 | R401.3 R401.4 25.65,13.39 v25.65,11.05 | 25.65,11.07 v25.65,11.05 | U801.2 8.64,15.75 9.64,15.75 | 9.64,15.75 U801.4 | 9.64,15.75 10.82,15.75 v12.04,16.97 12.04,21.26 U101.3 11.96,21.59 13.46,21.59 | C918.1 15.24,7.62 15.24,8.38 20.83,8.38 20.83,4.56 U920.1 21.34,4.56 21.34,4.45 22.35,4.45 C921.1 | U601.8 6.87,7.76 6.88,7.75 | 6.88,7.75 4.83,7.75 4.83,11.68 U601.3 | 7.49,3.79 6.88,3.79 6.88,6.1 | 6.88,6.1 6.88,7.75 | C914.1 6.88,6.1 | C613.2 11.18,11.43 | 11.18,11.43 v12.04,11.43 | C613.2 11.18,7.62 | 11.18,7.62 C918.1 | J401.8 16.76,21.59 | 16.76,21.59 13.46,21.59 | 13.46,21.59 U101.2 | C101.1 16.76,21.59 | 6.25,20.43 C802.1 v6.35,18.54 7.51,18.54 U801.13 | C914.1 8.89,6.1 8.89,6.86 11.18,6.86 11.18,7.62
  Bottom 0.152: U201.5 41.96,1.25 41.33,1.88 C215.1 40.59,1.93 32.08,1.93 v30.68,3.33 30.68,7.11 J701.4 | v12.04,11.43 v12.04,16.97 12.04,19.19 10.74,20.49 6.35,20.49 v6.35,18.54 | D402.2 D402.4 D402.6 20.87,11.05 v25.65,11.05
VIN
  Bottom 0.152: C204.1 46.48,4.9 S201.1 | D302.3 45.29,13.97 45.29,12.72 43.81,11.25 43.81,5.88 | U201.1 41.98,5.88 43.81,5.88 | 45.5,5.91 S201.1 | S201.1 43.81,5.88
VLIPO  (via drill 0.33)
  Top 0.152: v44.17,14.88 49.89,14.88 51.82,12.95 51.82,10.43 J301.2
  Bottom 0.152: U301.3 45.49,18.85 45.49,17.04 44.86,16.41 C301.1 44.81,16.2 44.17,16.2 v44.17,14.88 43.23,14.88 D302.2
XACC
  Top 0.152: U900.5 10.31,2.82 12.62,2.82 12.7,2.9 C905.1 12.75,2.95 12.8,3 15.82,3 U910.3
XTAL1
  Top 0.152: U401.17 32.77,15.81 Y401.2 32.65,16.71 C417.2
XTAL2
  Top 0.152: U401.16 33.53,13.71 33.53,15.56 Y401.1 33.64,16.71 C416.2
YACC
  Top 0.152: C904.1 9.6,1.07 | 9.6,1.07 9.63,1.09 9.63,2.13 U900.4 | 16.46,2.23 U910.4 16.47,0.51 14.73,0.51 14.22,1.02 C904.1 9.6,1.02 9.6,1.07
ZACC  (via drill 0.33)
  Top 0.152: U900.16 7.47,2.82 6.17,2.82 6.1,2.9 C916.1 v6.1,1.27 | U910.5 16.51,4.86 v16.51,3.56
  Bottom 0.152: v6.1,1.27 14.22,1.27 v16.51,3.56

### Text on the board
tPlace: 3V3 | SCL | SDA | TX0 | RX0 | GND | RST | VBUS | Baro | stkwans.blogspot.com | Compass | - | + | Acc/Gyro | v1.0 29 May 2013 | HighAcc
bPlace: St Kwan's Home for | the Terminally ADD | a division of | 3V3 | SCL | SDA | TX0 | RX0 | GND | RST | VBUS | Kwan Systems | Rst | On | Rocketometer32U4
bDocu: D